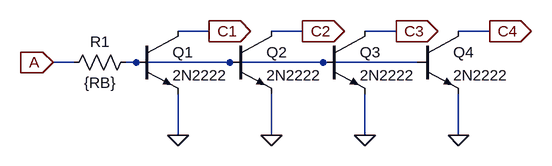
[diagram p0: schematic iilin4.asc]
iilin4.asc, the LTspice schematic file:
Version 4
SHEET 1 880 680
WIRE 240 192 192 192
WIRE 384 192 336 192
WIRE 528 192 480 192
WIRE 672 192 624 192
WIRE 32 240 0 240
WIRE 128 240 112 240
WIRE 272 240 128 240
WIRE 416 240 272 240
WIRE 560 240 416 240
WIRE 192 352 192 288
WIRE 336 352 336 288
WIRE 480 352 480 288
WIRE 624 352 624 288
FLAG 192 352 0
FLAG 240 192 C1
IOPIN 240 192 Out
FLAG 0 240 A
IOPIN 0 240 In
FLAG 336 352 0
FLAG 384 192 C2
IOPIN 384 192 Out
FLAG 480 352 0
FLAG 528 192 C3
IOPIN 528 192 Out
FLAG 624 352 0
FLAG 672 192 C4
IOPIN 672 192 Out
SYMBOL npn 128 192 R0
SYMATTR InstName Q1
SYMATTR Value 2N2222
SYMBOL res 16 256 R270
WINDOW 0 32 56 VTop 2
WINDOW 3 0 56 VBottom 2
SYMATTR InstName R1
SYMATTR Value {RB}
SYMBOL npn 272 192 R0
SYMATTR InstName Q2
SYMATTR Value 2N2222
SYMBOL npn 416 192 R0
SYMATTR InstName Q3
SYMATTR Value 2N2222
SYMBOL npn 560 192 R0
SYMATTR InstName Q4
SYMATTR Value 2N2222

The netlist it stands for:
* iilin4.asc
Q1 C1 N001 0 0 2N2222
R1 A N001 {RB}
Q2 C2 N001 0 0 2N2222
Q3 C3 N001 0 0 2N2222
Q4 C4 N001 0 0 2N2222
.model NPN NPN
.model PNP PNP
.lib standard.bjt
.backanno
.end